# Altium schematic sheet IO.SchDoc
size A; SheetNumber: 0; SheetTotal: 0
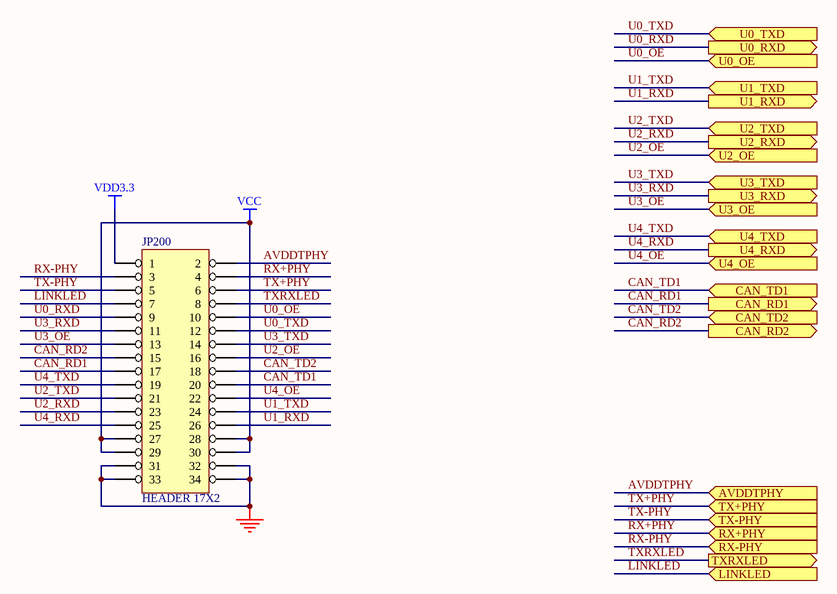
[diagram p0: IO.SchDoc]

## Parts
JP200  HEADER 17X2  [IDC34]

## Ports
AVDDTPHY (in), CAN_RD1 (out), CAN_RD2 (out), CAN_TD1 (in), CAN_TD2 (in), LINKLED (in), RX+PHY (in), RX-PHY (in), TX+PHY (in), TX-PHY (in), TXRXLED (out), U0_OE (in), U0_RXD (out), U0_TXD (in), U1_RXD (out), U1_TXD (in), U2_OE (in), U2_RXD (out), U2_TXD (in), U3_OE (in), U3_RXD (out), U3_TXD (in), U4_OE (in), U4_RXD (out), U4_TXD (in)

## Nets
GND: JP200.31 JP200.32 JP200.33 JP200.34
VCC: JP200.27 JP200.28 JP200.29 JP200.30
VDD3.3: JP200.1
AVDDTPHY: JP200.2 ; port AVDDTPHY
CAN_RD1: JP200.17 ; port CAN_RD1
CAN_RD2: JP200.15 ; port CAN_RD2
CAN_TD1: JP200.20 ; port CAN_TD1
CAN_TD2: JP200.18 ; port CAN_TD2
LINKLED: JP200.7 ; port LINKLED
RX+PHY: JP200.4 ; port RX+PHY
RX-PHY: JP200.3 ; port RX-PHY
TX+PHY: JP200.6 ; port TX+PHY
TX-PHY: JP200.5 ; port TX-PHY
TXRXLED: JP200.8 ; port TXRXLED
U0_OE: JP200.10 ; port U0_OE
U0_RXD: JP200.9 ; port U0_RXD
U0_TXD: JP200.12 ; port U0_TXD
U1_RXD: JP200.26 ; port U1_RXD
U1_TXD: JP200.24 ; port U1_TXD
U2_OE: JP200.16 ; port U2_OE
U2_RXD: JP200.23 ; port U2_RXD
U2_TXD: JP200.21 ; port U2_TXD
U3_OE: JP200.13 ; port U3_OE
U3_RXD: JP200.11 ; port U3_RXD
U3_TXD: JP200.14 ; port U3_TXD
U4_OE: JP200.22 ; port U4_OE
U4_RXD: JP200.25 ; port U4_RXD
U4_TXD: JP200.19 ; port U4_TXD